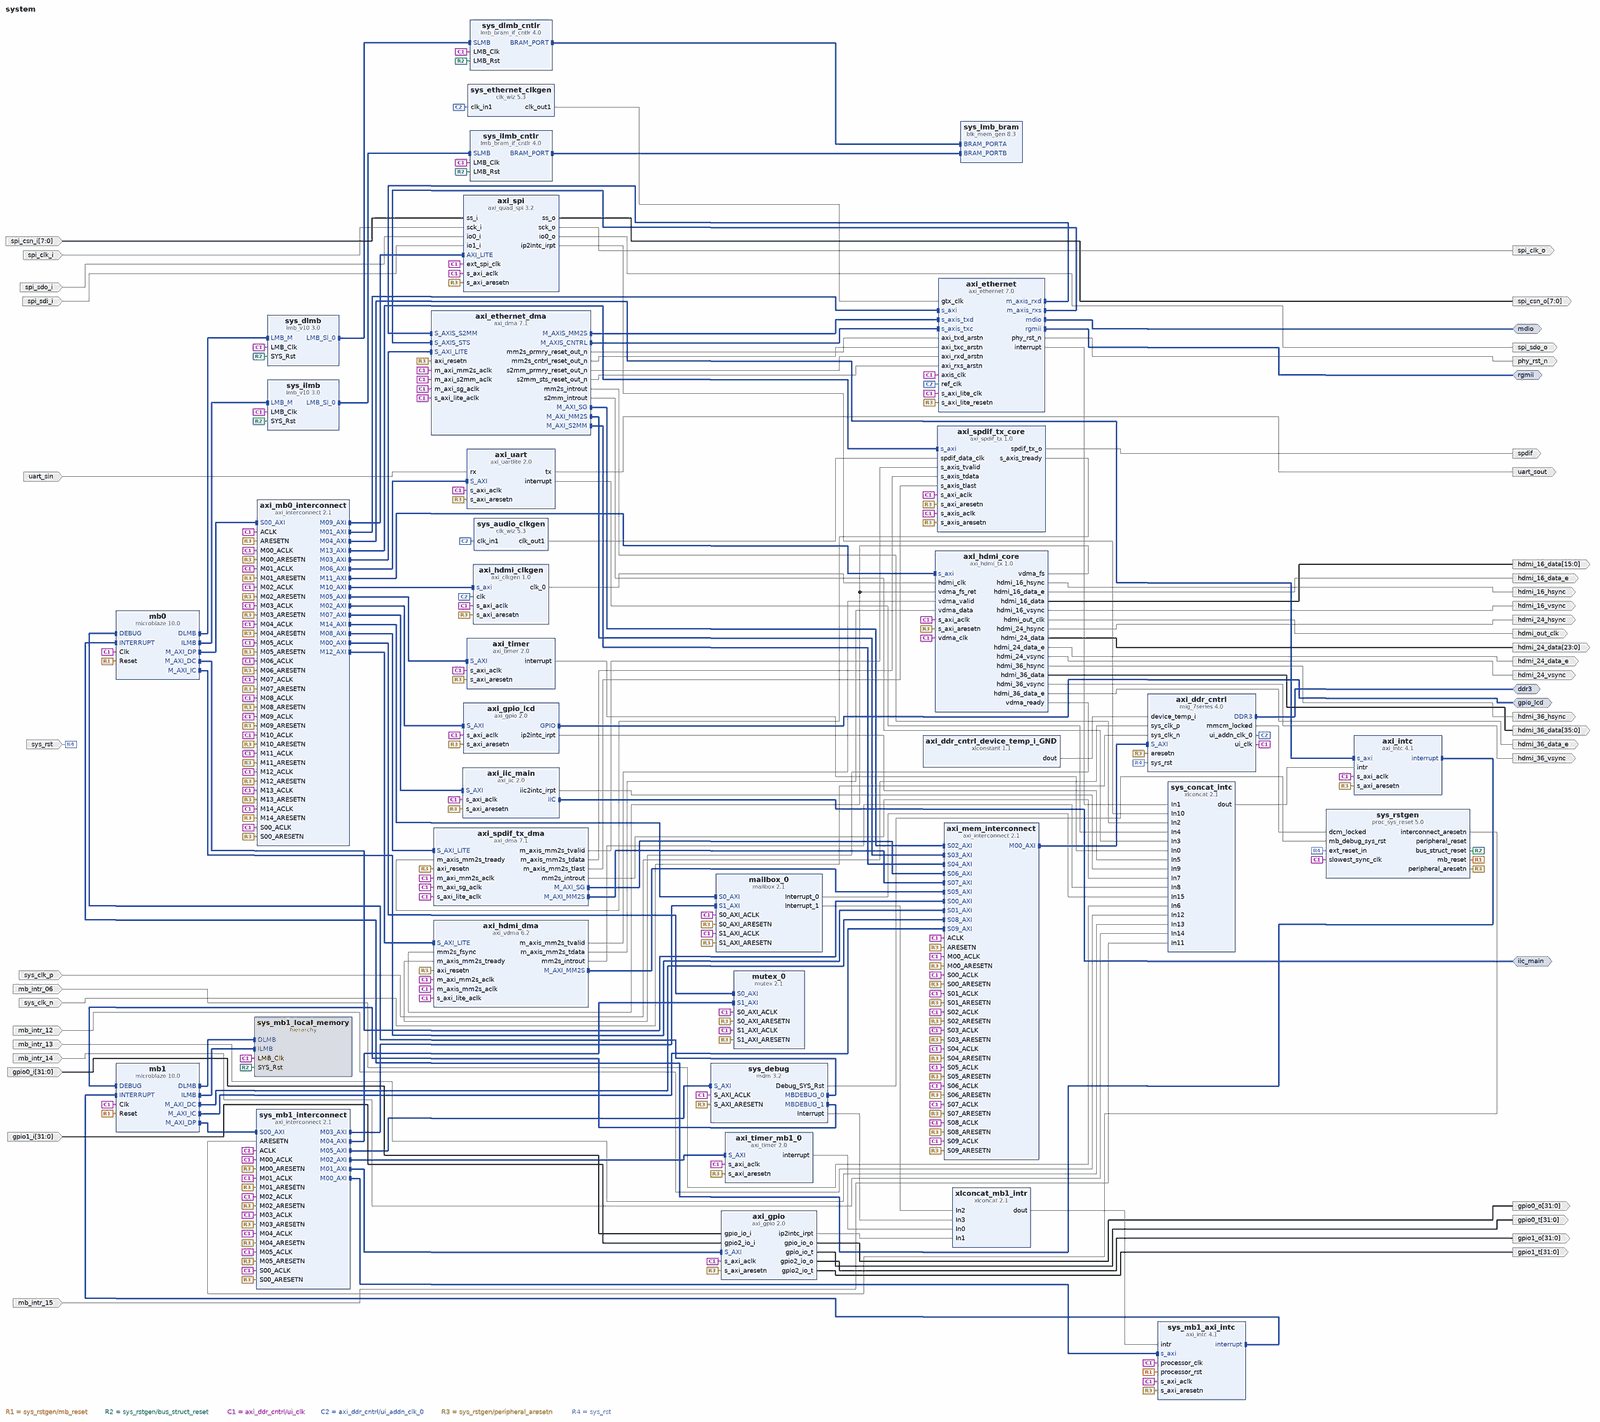
[diagram p0: block diagram of the top level, whole]
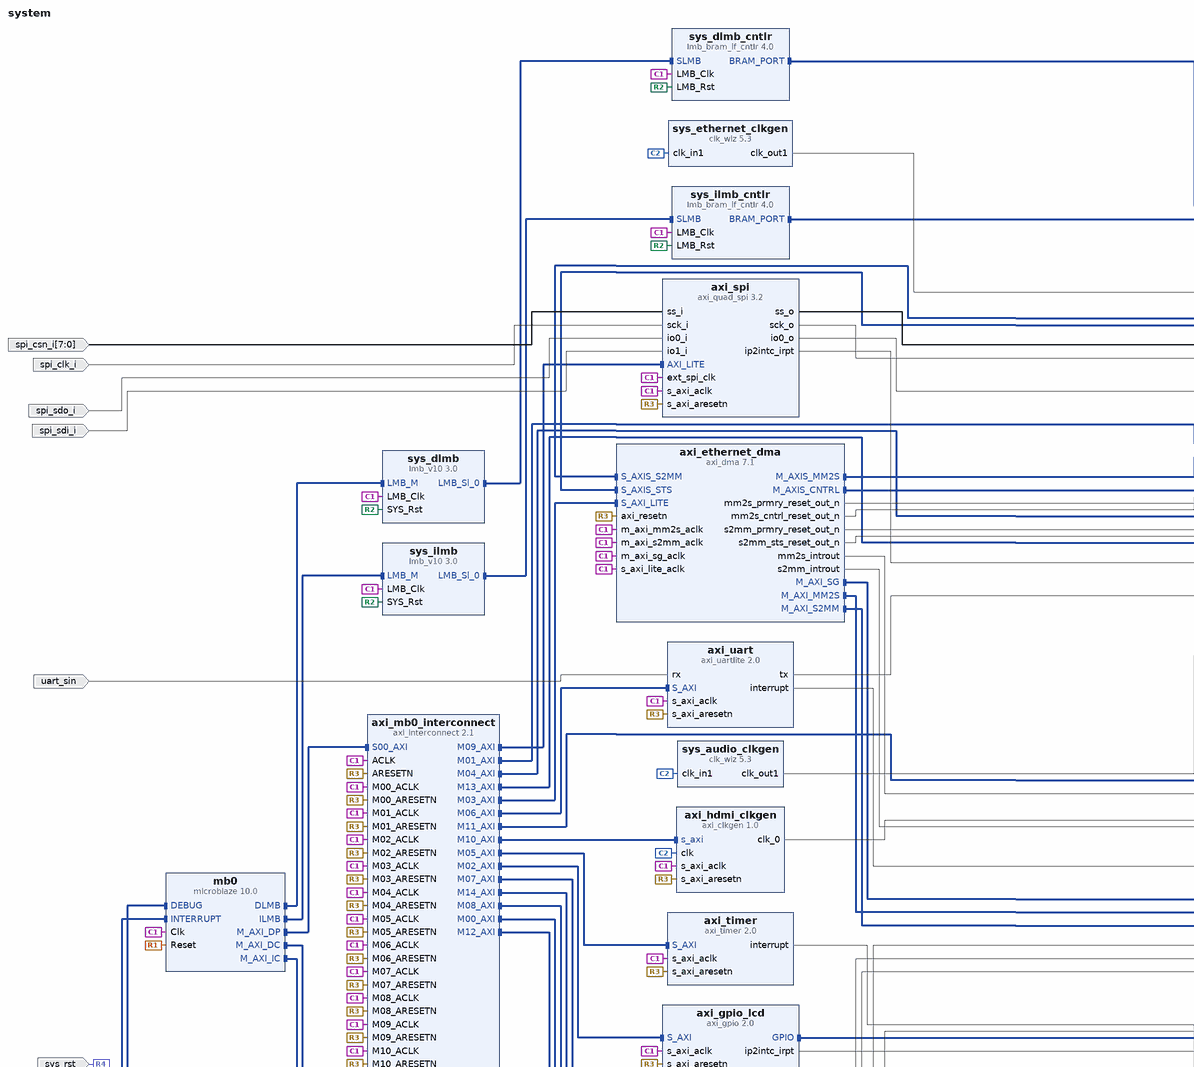
[diagram p1: block diagram of the top level, upper left part]
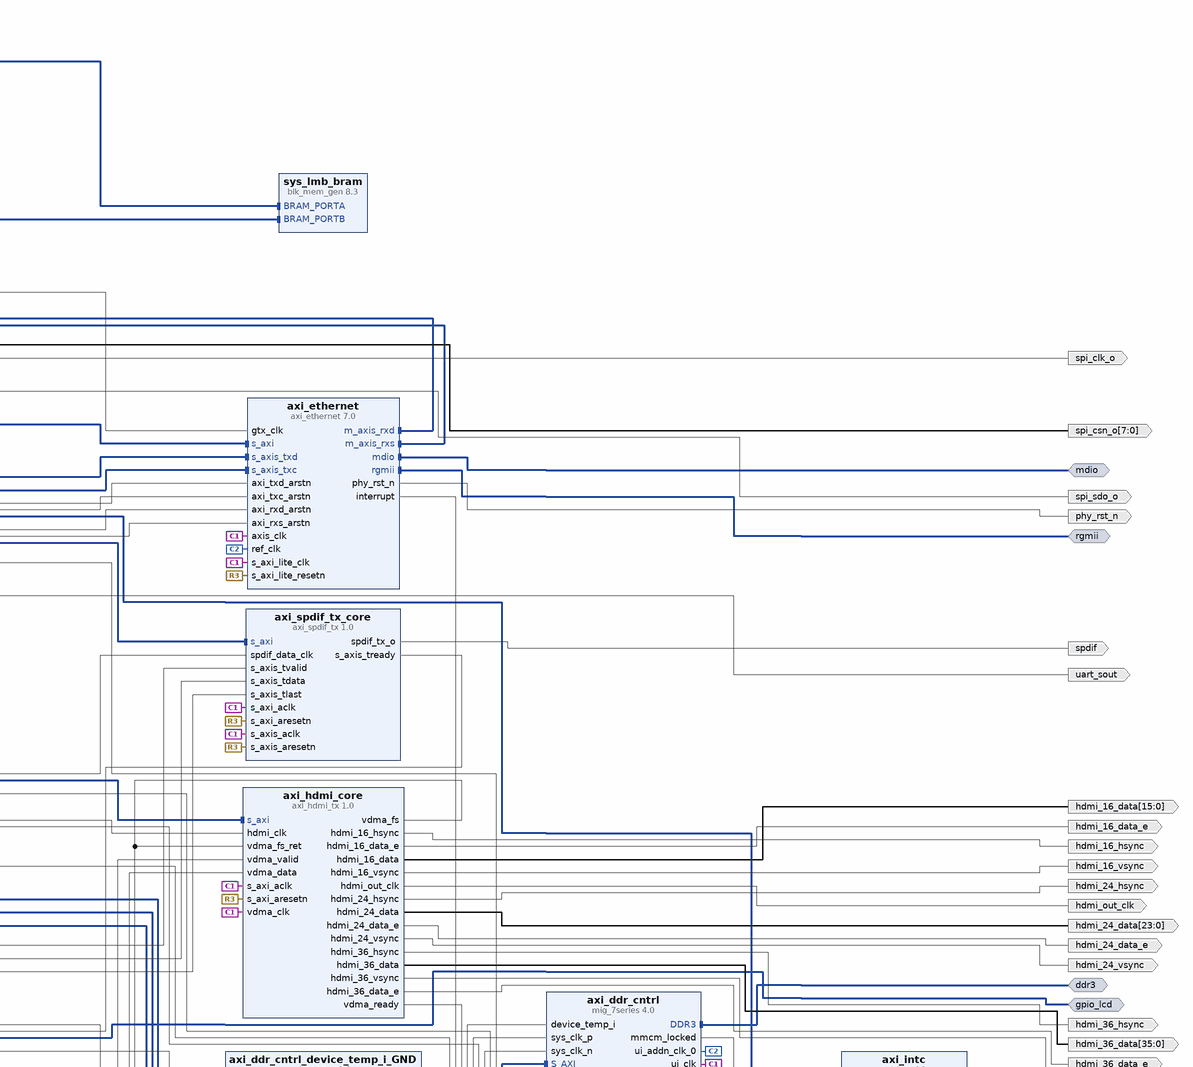
[diagram p2: block diagram of the top level, upper right part]
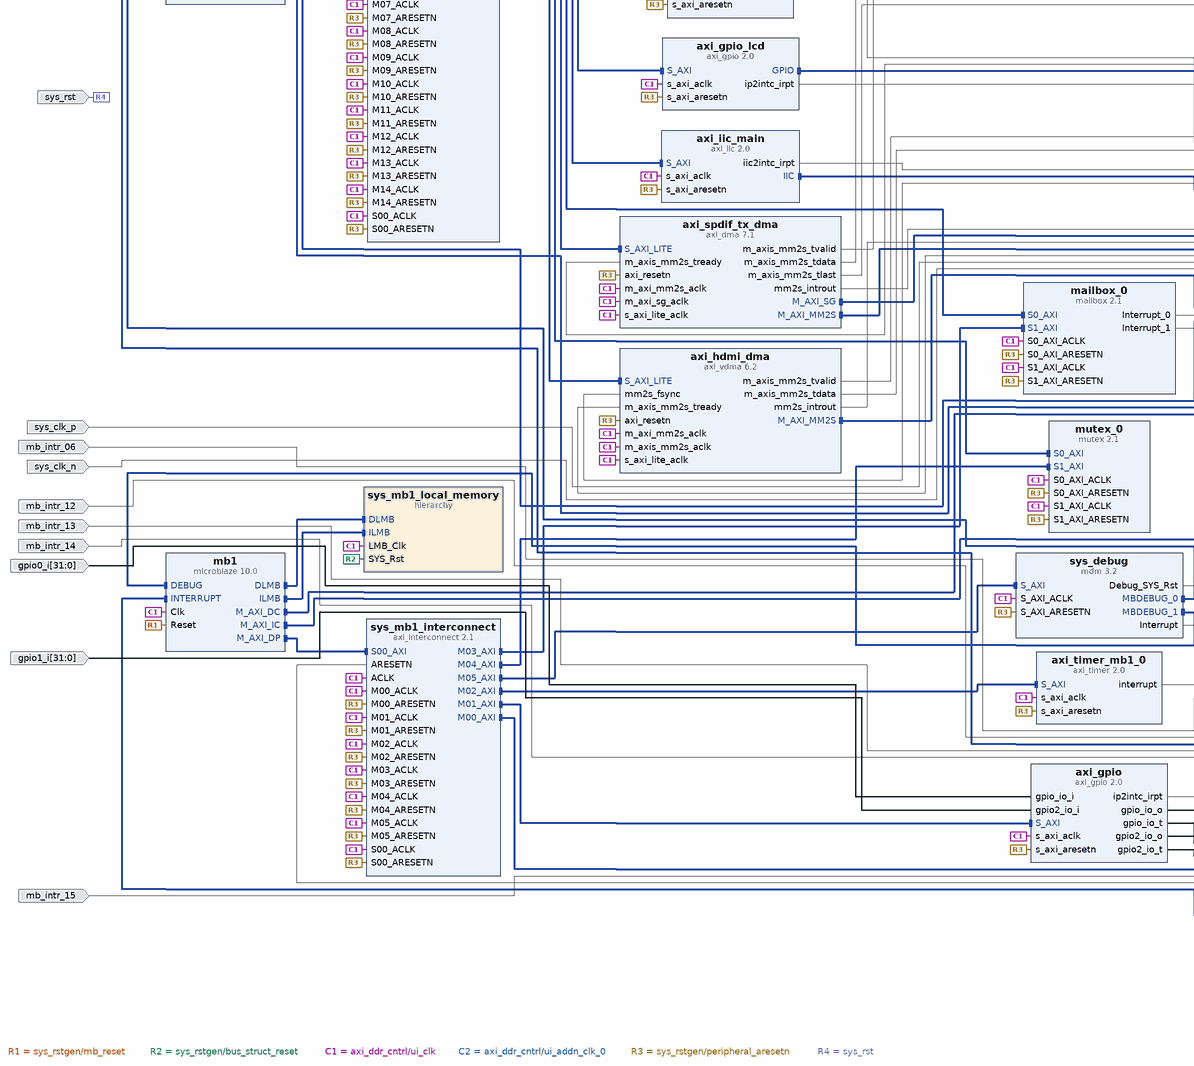
[diagram p3: block diagram of the top level, lower left part]
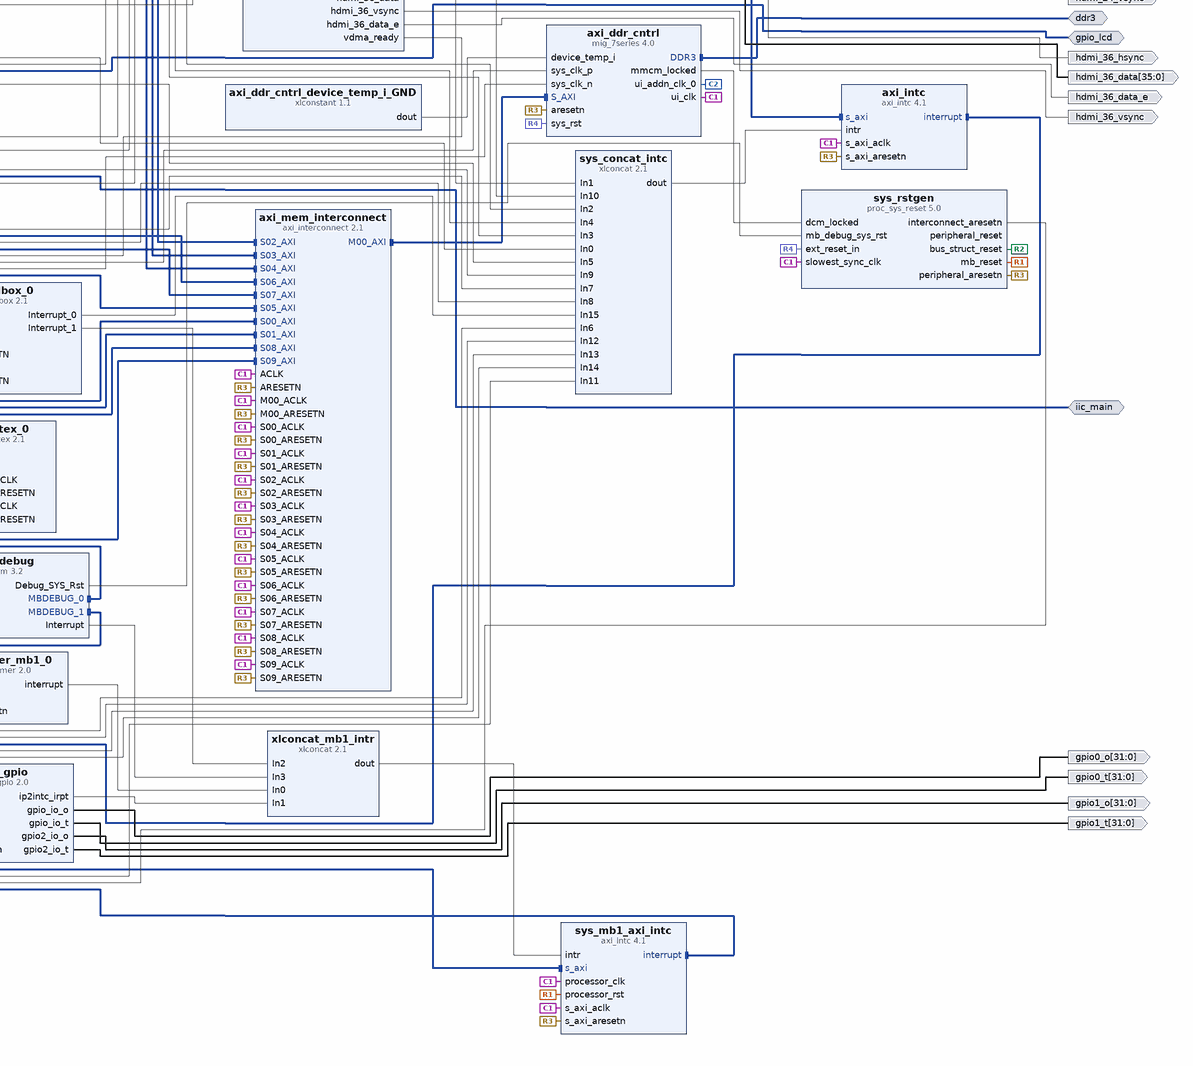
[diagram p4: block diagram of the top level, lower right part]
# Vivado block design system, xc7a200tfbg676-2, Vivado 2016.4
create_bd_design system

create_bd_intf_port -mode Master -vlnv xilinx.com:interface:ddrx_rtl:1.0 ddr3
create_bd_intf_port -mode Master -vlnv xilinx.com:interface:mdio_io:1.0 mdio
create_bd_intf_port -mode Master -vlnv xilinx.com:interface:rgmii_rtl:1.0 rgmii
create_bd_intf_port -mode Master -vlnv xilinx.com:interface:iic_rtl:1.0 iic_main
create_bd_intf_port -mode Master -vlnv xilinx.com:interface:gpio_rtl:1.0 gpio_lcd
create_bd_port -dir I -type intr mb_intr_06
create_bd_port -dir I -type intr mb_intr_12
create_bd_port -dir I -type intr mb_intr_13
create_bd_port -dir I -type intr mb_intr_14
create_bd_port -dir I -type rst sys_rst
set_property -dict {CONFIG.POLARITY ACTIVE_HIGH} [get_bd_ports sys_rst]
create_bd_port -dir I sys_clk_p
create_bd_port -dir I sys_clk_n
create_bd_port -dir I uart_sin
create_bd_port -dir O uart_sout
create_bd_port -dir I -from 7 -to 0 spi_csn_i
create_bd_port -dir O -from 7 -to 0 spi_csn_o
create_bd_port -dir I spi_clk_i
create_bd_port -dir O spi_clk_o
create_bd_port -dir I spi_sdo_i
create_bd_port -dir O spi_sdo_o
create_bd_port -dir I spi_sdi_i
create_bd_port -dir I -from 31 -to 0 gpio0_i
create_bd_port -dir O -from 31 -to 0 gpio0_o
create_bd_port -dir O -from 31 -to 0 gpio0_t
create_bd_port -dir I -from 31 -to 0 gpio1_i
create_bd_port -dir O -from 31 -to 0 gpio1_o
create_bd_port -dir O -from 31 -to 0 gpio1_t
create_bd_port -dir O -type rst phy_rst_n
create_bd_port -dir O hdmi_out_clk
create_bd_port -dir O hdmi_16_hsync
create_bd_port -dir O hdmi_16_vsync
create_bd_port -dir O hdmi_16_data_e
create_bd_port -dir O -from 15 -to 0 hdmi_16_data
create_bd_port -dir O hdmi_24_hsync
create_bd_port -dir O hdmi_24_vsync
create_bd_port -dir O hdmi_24_data_e
create_bd_port -dir O -from 23 -to 0 hdmi_24_data
create_bd_port -dir O hdmi_36_hsync
create_bd_port -dir O hdmi_36_vsync
create_bd_port -dir O hdmi_36_data_e
create_bd_port -dir O -from 35 -to 0 hdmi_36_data
create_bd_port -dir O spdif
create_bd_port -dir I -type intr mb_intr_15

create_bd_cell -type ip -vlnv xilinx.com:ip:microblaze:10.0 mb0
set_property -dict {CONFIG.G_TEMPLATE_LIST 4 CONFIG.C_CACHE_BYTE_SIZE 65536 CONFIG.C_DCACHE_BYTE_SIZE 65536} [get_bd_cells mb0]
create_bd_cell -type ip -vlnv xilinx.com:ip:lmb_v10:3.0 sys_dlmb
create_bd_cell -type ip -vlnv xilinx.com:ip:lmb_v10:3.0 sys_ilmb
create_bd_cell -type ip -vlnv xilinx.com:ip:lmb_bram_if_cntlr:4.0 sys_dlmb_cntlr
set_property -dict {CONFIG.C_ECC 0} [get_bd_cells sys_dlmb_cntlr]
create_bd_cell -type ip -vlnv xilinx.com:ip:lmb_bram_if_cntlr:4.0 sys_ilmb_cntlr
set_property -dict {CONFIG.C_ECC 0} [get_bd_cells sys_ilmb_cntlr]
create_bd_cell -type ip -vlnv xilinx.com:ip:blk_mem_gen:8.3 sys_lmb_bram
set_property -dict {CONFIG.Memory_Type True_Dual_Port_RAM CONFIG.use_bram_block BRAM_Controller} [get_bd_cells sys_lmb_bram]
create_bd_cell -type ip -vlnv xilinx.com:ip:mdm:3.2 sys_debug
set_property -dict [list \
  CONFIG.C_JTAG_CHAIN 2 \
  CONFIG.C_S_AXI_ADDR_WIDTH 5 \
  CONFIG.C_MB_DBG_PORTS 2 \
  CONFIG.C_USE_UART 1 \
  CONFIG.C_DBG_REG_ACCESS 1 \
  CONFIG.C_DBG_MEM_ACCESS 0 \
  CONFIG.C_USE_CROSS_TRIGGER 0 \
  CONFIG.C_TRACE_OUTPUT 0 \
] [get_bd_cells sys_debug]
create_bd_cell -type ip -vlnv xilinx.com:ip:proc_sys_reset:5.0 sys_rstgen
create_bd_cell -type ip -vlnv xilinx.com:ip:mig_7series:4.0 axi_ddr_cntrl
set_property -dict {CONFIG.XML_INPUT_FILE ac701_system_mig.prj} [get_bd_cells axi_ddr_cntrl]
create_bd_cell -type ip -vlnv xilinx.com:ip:clk_wiz:5.3 sys_ethernet_clkgen
set_property -dict {CONFIG.PRIM_IN_FREQ 200.000 CONFIG.CLKOUT1_REQUESTED_OUT_FREQ 125.000} [get_bd_cells sys_ethernet_clkgen]
create_bd_cell -type ip -vlnv xilinx.com:ip:axi_ethernet:7.0 axi_ethernet
set_property -dict {CONFIG.PHY_TYPE RGMII} [get_bd_cells axi_ethernet]
create_bd_cell -type ip -vlnv xilinx.com:ip:axi_dma:7.1 axi_ethernet_dma
set_property -dict [list \
  CONFIG.c_include_mm2s_dre 1 \
  CONFIG.c_sg_use_stsapp_length 1 \
  CONFIG.c_include_s2mm_dre 1 \
] [get_bd_cells axi_ethernet_dma]
create_bd_cell -type ip -vlnv xilinx.com:ip:axi_iic:2.0 axi_iic_main
create_bd_cell -type ip -vlnv xilinx.com:ip:axi_uartlite:2.0 axi_uart
set_property -dict {CONFIG.C_BAUDRATE 115200} [get_bd_cells axi_uart]
create_bd_cell -type ip -vlnv xilinx.com:ip:axi_timer:2.0 axi_timer
create_bd_cell -type ip -vlnv xilinx.com:ip:axi_gpio:2.0 axi_gpio_lcd
set_property -dict {CONFIG.C_GPIO_WIDTH 7 CONFIG.C_INTERRUPT_PRESENT 1} [get_bd_cells axi_gpio_lcd]
create_bd_cell -type ip -vlnv xilinx.com:ip:axi_quad_spi:3.2 axi_spi
set_property -dict {CONFIG.C_USE_STARTUP 0 CONFIG.C_NUM_SS_BITS 8 CONFIG.C_SCK_RATIO 8} [get_bd_cells axi_spi]
create_bd_cell -type ip -vlnv xilinx.com:ip:axi_gpio:2.0 axi_gpio
set_property -dict [list \
  CONFIG.C_GPIO_WIDTH 32 \
  CONFIG.C_GPIO2_WIDTH 32 \
  CONFIG.C_IS_DUAL 1 \
  CONFIG.C_INTERRUPT_PRESENT 1 \
] [get_bd_cells axi_gpio]
create_bd_cell -type ip -vlnv xilinx.com:ip:axi_intc:4.1 axi_intc
set_property -dict {CONFIG.C_HAS_FAST 0} [get_bd_cells axi_intc]
create_bd_cell -type ip -vlnv xilinx.com:ip:xlconcat:2.1 sys_concat_intc
set_property -dict {CONFIG.NUM_PORTS 16} [get_bd_cells sys_concat_intc]
create_bd_cell -type ip -vlnv xilinx.com:ip:xlconstant:1.1 axi_ddr_cntrl_device_temp_i_GND
set_property -dict {CONFIG.CONST_WIDTH 12 CONFIG.CONST_VAL 0} [get_bd_cells axi_ddr_cntrl_device_temp_i_GND]
create_bd_cell -type ip -vlnv xilinx.com:ip:axi_interconnect:2.1 axi_mb0_interconnect
set_property -dict {CONFIG.NUM_MI 15} [get_bd_cells axi_mb0_interconnect]
create_bd_cell -type ip -vlnv xilinx.com:ip:axi_interconnect:2.1 axi_mem_interconnect
set_property -dict {CONFIG.NUM_SI 10 CONFIG.NUM_MI 1 CONFIG.STRATEGY 2} [get_bd_cells axi_mem_interconnect]
create_bd_cell -type ip -vlnv analog.com:user:axi_clkgen:1.0 axi_hdmi_clkgen
create_bd_cell -type ip -vlnv analog.com:user:axi_hdmi_tx:1.0 axi_hdmi_core
create_bd_cell -type ip -vlnv xilinx.com:ip:axi_vdma:6.2 axi_hdmi_dma
set_property -dict [list \
  CONFIG.c_m_axi_mm2s_data_width 512 \
  CONFIG.c_m_axis_mm2s_tdata_width 64 \
  CONFIG.c_use_mm2s_fsync 1 \
  CONFIG.c_include_s2mm 0 \
] [get_bd_cells axi_hdmi_dma]
create_bd_cell -type ip -vlnv xilinx.com:ip:clk_wiz:5.3 sys_audio_clkgen
set_property -dict [list \
  CONFIG.USE_PHASE_ALIGNMENT false \
  CONFIG.CLKOUT1_REQUESTED_OUT_FREQ 12.288 \
  CONFIG.PRIM_SOURCE No_buffer \
  CONFIG.USE_LOCKED false \
  CONFIG.USE_RESET false \
] [get_bd_cells sys_audio_clkgen]
create_bd_cell -type ip -vlnv analog.com:user:axi_spdif_tx:1.0 axi_spdif_tx_core
set_property -dict {CONFIG.S_AXI_ADDRESS_WIDTH 16 CONFIG.DMA_TYPE 0} [get_bd_cells axi_spdif_tx_core]
create_bd_cell -type ip -vlnv xilinx.com:ip:axi_dma:7.1 axi_spdif_tx_dma
set_property -dict {CONFIG.c_sg_include_stscntrl_strm 0 CONFIG.c_include_s2mm 0} [get_bd_cells axi_spdif_tx_dma]
create_bd_cell -type ip -vlnv xilinx.com:ip:microblaze:10.0 mb1
set_property -dict [list \
  CONFIG.C_D_AXI 1 \
  CONFIG.C_D_LMB 1 \
  CONFIG.C_I_LMB 1 \
  CONFIG.G_TEMPLATE_LIST 4 \
  CONFIG.C_DEBUG_ENABLED 2 \
  CONFIG.C_FSL_LINKS 0 \
  CONFIG.C_USE_ICACHE 1 \
  CONFIG.C_CACHE_BYTE_SIZE 8192 \
  CONFIG.C_USE_DCACHE 1 \
  CONFIG.C_DCACHE_BYTE_SIZE 8192 \
] [get_bd_cells mb1]
create_bd_cell -type hier sys_mb1_local_memory
create_bd_cell -type ip -vlnv xilinx.com:ip:axi_interconnect:2.1 sys_mb1_interconnect
set_property -dict {CONFIG.NUM_MI 6} [get_bd_cells sys_mb1_interconnect]
create_bd_cell -type ip -vlnv xilinx.com:ip:axi_intc:4.1 sys_mb1_axi_intc
set_property -dict {CONFIG.C_HAS_FAST 1} [get_bd_cells sys_mb1_axi_intc]
create_bd_cell -type ip -vlnv xilinx.com:ip:axi_timer:2.0 axi_timer_mb1_0
create_bd_cell -type ip -vlnv xilinx.com:ip:mailbox:2.1 mailbox_0
set_property -dict {CONFIG.C_ASYNC_CLKS 0 CONFIG.C_IMPL_STYLE 0 CONFIG.C_MAILBOX_DEPTH 16} [get_bd_cells mailbox_0]
create_bd_cell -type ip -vlnv xilinx.com:ip:xlconcat:2.1 xlconcat_mb1_intr
set_property -dict {CONFIG.NUM_PORTS 4} [get_bd_cells xlconcat_mb1_intr]
create_bd_cell -type ip -vlnv xilinx.com:ip:mutex:2.1 mutex_0

# ---- hierarchy /sys_mb1_local_memory ----
current_bd_instance /sys_mb1_local_memory
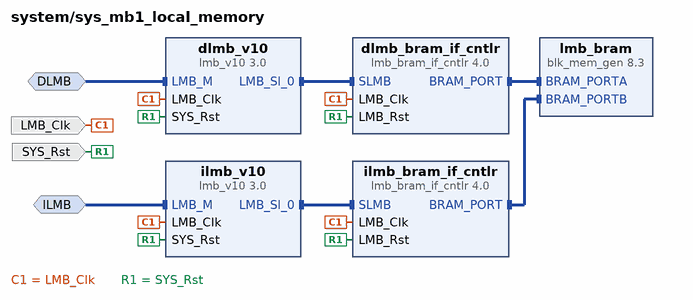
[diagram p5: block diagram inside /sys_mb1_local_memory]
create_bd_intf_pin -mode MirroredMaster -vlnv xilinx.com:interface:lmb_rtl:1.0 DLMB
create_bd_intf_pin -mode MirroredMaster -vlnv xilinx.com:interface:lmb_rtl:1.0 ILMB
create_bd_pin -dir I -type clk LMB_Clk
create_bd_pin -dir I -type rst SYS_Rst

create_bd_cell -type ip -vlnv xilinx.com:ip:lmb_v10:3.0 dlmb_v10
create_bd_cell -type ip -vlnv xilinx.com:ip:lmb_v10:3.0 ilmb_v10
create_bd_cell -type ip -vlnv xilinx.com:ip:lmb_bram_if_cntlr:4.0 dlmb_bram_if_cntlr
set_property -dict {CONFIG.C_ECC 0} [get_bd_cells dlmb_bram_if_cntlr]
create_bd_cell -type ip -vlnv xilinx.com:ip:lmb_bram_if_cntlr:4.0 ilmb_bram_if_cntlr
set_property -dict {CONFIG.C_ECC 0} [get_bd_cells ilmb_bram_if_cntlr]
create_bd_cell -type ip -vlnv xilinx.com:ip:blk_mem_gen:8.3 lmb_bram
set_property -dict {CONFIG.Memory_Type True_Dual_Port_RAM CONFIG.use_bram_block BRAM_Controller} [get_bd_cells lmb_bram]

# ---- connections ----

current_bd_instance /sys_mb1_local_memory
connect_bd_intf_net -intf_net sys_mb1_dlmb_bus [get_bd_intf_pins dlmb_v10/LMB_Sl_0] [get_bd_intf_pins dlmb_bram_if_cntlr/SLMB]
connect_bd_intf_net -intf_net sys_mb1_ilmb_bus [get_bd_intf_pins ilmb_v10/LMB_Sl_0] [get_bd_intf_pins ilmb_bram_if_cntlr/SLMB]
connect_bd_intf_net -intf_net sys_mb1_dlmb_cntlr [get_bd_intf_pins dlmb_bram_if_cntlr/BRAM_PORT] [get_bd_intf_pins lmb_bram/BRAM_PORTA]
connect_bd_intf_net -intf_net sys_mb1_ilmb_cntlr [get_bd_intf_pins ilmb_bram_if_cntlr/BRAM_PORT] [get_bd_intf_pins lmb_bram/BRAM_PORTB]
connect_bd_intf_net -intf_net sys_mb1_dlmb [get_bd_intf_pins DLMB] [get_bd_intf_pins dlmb_v10/LMB_M]
connect_bd_intf_net -intf_net sys_mb1_ilmb [get_bd_intf_pins ILMB] [get_bd_intf_pins ilmb_v10/LMB_M]
connect_bd_net -net sys_mb1_Clk [get_bd_pins LMB_Clk] \
  [get_bd_pins dlmb_v10/LMB_Clk] [get_bd_pins dlmb_bram_if_cntlr/LMB_Clk] [get_bd_pins ilmb_v10/LMB_Clk] \
  [get_bd_pins ilmb_bram_if_cntlr/LMB_Clk]
connect_bd_net [get_bd_pins SYS_Rst] \
  [get_bd_pins dlmb_v10/SYS_Rst] [get_bd_pins dlmb_bram_if_cntlr/LMB_Rst] [get_bd_pins ilmb_v10/SYS_Rst] \
  [get_bd_pins ilmb_bram_if_cntlr/LMB_Rst]

current_bd_instance /
connect_bd_intf_net [get_bd_intf_pins sys_dlmb/LMB_Sl_0] [get_bd_intf_pins sys_dlmb_cntlr/SLMB]
connect_bd_intf_net [get_bd_intf_pins sys_ilmb/LMB_Sl_0] [get_bd_intf_pins sys_ilmb_cntlr/SLMB]
connect_bd_intf_net [get_bd_intf_pins sys_dlmb_cntlr/BRAM_PORT] [get_bd_intf_pins sys_lmb_bram/BRAM_PORTA]
connect_bd_intf_net [get_bd_intf_pins sys_ilmb_cntlr/BRAM_PORT] [get_bd_intf_pins sys_lmb_bram/BRAM_PORTB]
connect_bd_intf_net -intf_net sys_mb_DLMB [get_bd_intf_pins mb0/DLMB] [get_bd_intf_pins sys_dlmb/LMB_M]
connect_bd_intf_net -intf_net sys_mb_ILMB [get_bd_intf_pins mb0/ILMB] [get_bd_intf_pins sys_ilmb/LMB_M]
connect_bd_intf_net [get_bd_intf_pins axi_intc/interrupt] [get_bd_intf_pins mb0/INTERRUPT]
connect_bd_intf_net [get_bd_intf_pins axi_ethernet/s_axis_txd] [get_bd_intf_pins axi_ethernet_dma/M_AXIS_MM2S]
connect_bd_intf_net [get_bd_intf_pins axi_ethernet/s_axis_txc] [get_bd_intf_pins axi_ethernet_dma/M_AXIS_CNTRL]
connect_bd_intf_net [get_bd_intf_pins axi_ethernet/m_axis_rxd] [get_bd_intf_pins axi_ethernet_dma/S_AXIS_S2MM]
connect_bd_intf_net [get_bd_intf_pins axi_ethernet/m_axis_rxs] [get_bd_intf_pins axi_ethernet_dma/S_AXIS_STS]
connect_bd_intf_net [get_bd_intf_pins axi_mb0_interconnect/S00_AXI] [get_bd_intf_pins mb0/M_AXI_DP]
connect_bd_intf_net -intf_net axi_cpu_interconnect_M01_AXI [get_bd_intf_pins axi_mb0_interconnect/M01_AXI] [get_bd_intf_pins axi_ethernet/s_axi]
connect_bd_intf_net -intf_net axi_cpu_interconnect_M02_AXI [get_bd_intf_pins axi_mb0_interconnect/M02_AXI] [get_bd_intf_pins axi_gpio_lcd/S_AXI]
connect_bd_intf_net -intf_net axi_cpu_interconnect_M03_AXI [get_bd_intf_pins axi_mb0_interconnect/M03_AXI] [get_bd_intf_pins axi_ethernet_dma/S_AXI_LITE]
connect_bd_intf_net -intf_net axi_cpu_interconnect_M04_AXI [get_bd_intf_pins axi_mb0_interconnect/M04_AXI] [get_bd_intf_pins axi_intc/s_axi]
connect_bd_intf_net -intf_net axi_cpu_interconnect_M05_AXI [get_bd_intf_pins axi_mb0_interconnect/M05_AXI] [get_bd_intf_pins axi_timer/S_AXI]
connect_bd_intf_net -intf_net axi_cpu_interconnect_M07_AXI [get_bd_intf_pins axi_mb0_interconnect/M07_AXI] [get_bd_intf_pins axi_iic_main/S_AXI]
connect_bd_intf_net -intf_net axi_cpu_interconnect_M09_AXI [get_bd_intf_pins axi_mb0_interconnect/M09_AXI] [get_bd_intf_pins axi_spi/AXI_LITE]
connect_bd_intf_net [get_bd_intf_pins axi_mem_interconnect/M00_AXI] [get_bd_intf_pins axi_ddr_cntrl/S_AXI]
connect_bd_intf_net [get_bd_intf_pins axi_mem_interconnect/S00_AXI] [get_bd_intf_pins mb0/M_AXI_DC]
connect_bd_intf_net [get_bd_intf_pins axi_mem_interconnect/S01_AXI] [get_bd_intf_pins mb0/M_AXI_IC]
connect_bd_intf_net [get_bd_intf_pins axi_mem_interconnect/S02_AXI] [get_bd_intf_pins axi_ethernet_dma/M_AXI_SG]
connect_bd_intf_net [get_bd_intf_pins axi_mem_interconnect/S03_AXI] [get_bd_intf_pins axi_ethernet_dma/M_AXI_MM2S]
connect_bd_intf_net [get_bd_intf_pins axi_mem_interconnect/S04_AXI] [get_bd_intf_pins axi_ethernet_dma/M_AXI_S2MM]
connect_bd_intf_net -intf_net axi_cpu_interconnect_M10_AXI [get_bd_intf_pins axi_mb0_interconnect/M10_AXI] [get_bd_intf_pins axi_hdmi_clkgen/s_axi]
connect_bd_intf_net -intf_net axi_cpu_interconnect_M11_AXI [get_bd_intf_pins axi_mb0_interconnect/M11_AXI] [get_bd_intf_pins axi_hdmi_core/s_axi]
connect_bd_intf_net -intf_net axi_cpu_interconnect_M12_AXI [get_bd_intf_pins axi_mb0_interconnect/M12_AXI] [get_bd_intf_pins axi_hdmi_dma/S_AXI_LITE]
connect_bd_intf_net -intf_net axi_cpu_interconnect_M13_AXI [get_bd_intf_pins axi_mb0_interconnect/M13_AXI] [get_bd_intf_pins axi_spdif_tx_core/s_axi]
connect_bd_intf_net [get_bd_intf_pins axi_mem_interconnect/S05_AXI] [get_bd_intf_pins axi_hdmi_dma/M_AXI_MM2S]
connect_bd_intf_net [get_bd_intf_pins axi_mem_interconnect/S06_AXI] [get_bd_intf_pins axi_spdif_tx_dma/M_AXI_SG]
connect_bd_intf_net [get_bd_intf_pins axi_mem_interconnect/S07_AXI] [get_bd_intf_pins axi_spdif_tx_dma/M_AXI_MM2S]
connect_bd_intf_net -intf_net sys_mb1_dlmb_1 [get_bd_intf_pins mb1/DLMB] [get_bd_intf_pins sys_mb1_local_memory/DLMB]
connect_bd_intf_net -intf_net sys_mb1_ilmb_1 [get_bd_intf_pins mb1/ILMB] [get_bd_intf_pins sys_mb1_local_memory/ILMB]
connect_bd_intf_net -intf_net sys_mb1_axi_dp [get_bd_intf_pins sys_mb1_interconnect/S00_AXI] [get_bd_intf_pins mb1/M_AXI_DP]
connect_bd_intf_net -intf_net sys_mb1_interrupt [get_bd_intf_pins sys_mb1_axi_intc/interrupt] [get_bd_intf_pins mb1/INTERRUPT]
connect_bd_intf_net -intf_net sys_mb1_intc_axi [get_bd_intf_pins sys_mb1_interconnect/M00_AXI] [get_bd_intf_pins sys_mb1_axi_intc/s_axi]
connect_bd_intf_net -intf_net sys_mb1_M_AXI_DC [get_bd_intf_pins mb1/M_AXI_DC] [get_bd_intf_pins axi_mem_interconnect/S08_AXI]
connect_bd_intf_net -intf_net sys_mb1_M_AXI_IC [get_bd_intf_pins mb1/M_AXI_IC] [get_bd_intf_pins axi_mem_interconnect/S09_AXI]
connect_bd_intf_net [get_bd_intf_pins axi_gpio/S_AXI] [get_bd_intf_pins sys_mb1_interconnect/M01_AXI]
connect_bd_intf_net -intf_net axi_cpu_interconnect_M08_AXI [get_bd_intf_pins axi_spdif_tx_dma/S_AXI_LITE] [get_bd_intf_pins axi_mb0_interconnect/M08_AXI]
connect_bd_intf_net [get_bd_intf_pins axi_timer_mb1_0/S_AXI] [get_bd_intf_pins sys_mb1_interconnect/M02_AXI]
connect_bd_intf_net [get_bd_intf_pins mailbox_0/S1_AXI] [get_bd_intf_pins sys_mb1_interconnect/M03_AXI]
connect_bd_intf_net -intf_net axi_cpu_interconnect_M14_AXI [get_bd_intf_pins axi_mb0_interconnect/M14_AXI] [get_bd_intf_pins mailbox_0/S0_AXI]
connect_bd_intf_net -intf_net axi_cpu_interconnect_M06_AXI [get_bd_intf_pins axi_uart/S_AXI] [get_bd_intf_pins axi_mb0_interconnect/M06_AXI]
connect_bd_intf_net [get_bd_intf_pins mutex_0/S1_AXI] [get_bd_intf_pins sys_mb1_interconnect/M04_AXI]
connect_bd_intf_net [get_bd_intf_pins sys_debug/S_AXI] [get_bd_intf_pins sys_mb1_interconnect/M05_AXI]
connect_bd_intf_net [get_bd_intf_pins mutex_0/S0_AXI] [get_bd_intf_pins axi_mb0_interconnect/M00_AXI]
connect_bd_intf_net [get_bd_intf_pins sys_debug/MBDEBUG_1] [get_bd_intf_pins mb1/DEBUG]
connect_bd_intf_net [get_bd_intf_pins mb0/DEBUG] [get_bd_intf_pins sys_debug/MBDEBUG_0]
connect_bd_intf_net [get_bd_intf_ports ddr3] [get_bd_intf_pins axi_ddr_cntrl/DDR3]
connect_bd_intf_net [get_bd_intf_ports mdio] [get_bd_intf_pins axi_ethernet/mdio]
connect_bd_intf_net [get_bd_intf_ports rgmii] [get_bd_intf_pins axi_ethernet/rgmii]
connect_bd_intf_net [get_bd_intf_ports iic_main] [get_bd_intf_pins axi_iic_main/IIC]
connect_bd_intf_net [get_bd_intf_ports gpio_lcd] [get_bd_intf_pins axi_gpio_lcd/GPIO]
connect_bd_net -net mdm_1_debug_sys_rst [get_bd_pins sys_debug/Debug_SYS_Rst] [get_bd_pins sys_rstgen/mb_debug_sys_rst]
connect_bd_net [get_bd_pins sys_rstgen/mb_reset] [get_bd_pins mb0/Reset] [get_bd_pins mb1/Reset] [get_bd_pins sys_mb1_axi_intc/processor_rst]
connect_bd_net [get_bd_pins sys_rstgen/bus_struct_reset] \
  [get_bd_pins sys_dlmb/SYS_Rst] [get_bd_pins sys_ilmb/SYS_Rst] [get_bd_pins sys_dlmb_cntlr/LMB_Rst] \
  [get_bd_pins sys_ilmb_cntlr/LMB_Rst] [get_bd_pins sys_mb1_local_memory/SYS_Rst]
connect_bd_net [get_bd_pins sys_concat_intc/dout] [get_bd_pins axi_intc/intr]
connect_bd_net [get_bd_pins axi_ddr_cntrl/mmcm_locked] [get_bd_pins sys_rstgen/dcm_locked]
connect_bd_net [get_bd_pins axi_ddr_cntrl_device_temp_i_GND/dout] [get_bd_pins axi_ddr_cntrl/device_temp_i]
connect_bd_net -net sys_mb1_Clk [get_bd_pins axi_ddr_cntrl/ui_clk] \
  [get_bd_pins sys_rstgen/slowest_sync_clk] [get_bd_pins mb0/Clk] [get_bd_pins sys_dlmb/LMB_Clk] \
  [get_bd_pins sys_ilmb/LMB_Clk] [get_bd_pins sys_dlmb_cntlr/LMB_Clk] [get_bd_pins sys_ilmb_cntlr/LMB_Clk] \
  [get_bd_pins axi_spi/ext_spi_clk] [get_bd_pins axi_ethernet/axis_clk] [get_bd_pins sys_debug/S_AXI_ACLK] \
  [get_bd_pins axi_ethernet/s_axi_lite_clk] [get_bd_pins axi_gpio_lcd/s_axi_aclk] \
  [get_bd_pins axi_ethernet_dma/s_axi_lite_aclk] [get_bd_pins axi_intc/s_axi_aclk] [get_bd_pins axi_timer/s_axi_aclk] \
  [get_bd_pins axi_uart/s_axi_aclk] [get_bd_pins axi_iic_main/s_axi_aclk] [get_bd_pins axi_gpio/s_axi_aclk] \
  [get_bd_pins axi_spi/s_axi_aclk] [get_bd_pins axi_ethernet_dma/m_axi_sg_aclk] \
  [get_bd_pins axi_ethernet_dma/m_axi_mm2s_aclk] [get_bd_pins axi_ethernet_dma/m_axi_s2mm_aclk] \
  [get_bd_pins axi_hdmi_core/vdma_clk] [get_bd_pins axi_hdmi_dma/m_axis_mm2s_aclk] \
  [get_bd_pins axi_spdif_tx_core/s_axis_aclk] [get_bd_pins axi_hdmi_clkgen/s_axi_aclk] [get_bd_pins axi_hdmi_core/s_axi_aclk] \
  [get_bd_pins axi_hdmi_dma/s_axi_lite_aclk] [get_bd_pins axi_spdif_tx_core/s_axi_aclk] \
  [get_bd_pins axi_spdif_tx_dma/s_axi_lite_aclk] [get_bd_pins axi_hdmi_dma/m_axi_mm2s_aclk] \
  [get_bd_pins axi_spdif_tx_dma/m_axi_sg_aclk] [get_bd_pins axi_spdif_tx_dma/m_axi_mm2s_aclk] [get_bd_pins mb1/Clk] \
  [get_bd_pins sys_mb1_axi_intc/s_axi_aclk] [get_bd_pins sys_mb1_axi_intc/processor_clk] [get_bd_pins mailbox_0/S1_AXI_ACLK] \
  [get_bd_pins mailbox_0/S0_AXI_ACLK] [get_bd_pins axi_timer_mb1_0/s_axi_aclk] [get_bd_pins mutex_0/S0_AXI_ACLK] \
  [get_bd_pins mutex_0/S1_AXI_ACLK] [get_bd_pins axi_mb0_interconnect/ACLK] [get_bd_pins axi_mb0_interconnect/S00_ACLK] \
  [get_bd_pins axi_mb0_interconnect/M00_ACLK] [get_bd_pins axi_mb0_interconnect/M01_ACLK] \
  [get_bd_pins axi_mb0_interconnect/M02_ACLK] [get_bd_pins axi_mb0_interconnect/M03_ACLK] \
  [get_bd_pins axi_mb0_interconnect/M04_ACLK] [get_bd_pins axi_mb0_interconnect/M05_ACLK] \
  [get_bd_pins axi_mb0_interconnect/M06_ACLK] [get_bd_pins axi_mb0_interconnect/M07_ACLK] \
  [get_bd_pins axi_mb0_interconnect/M08_ACLK] [get_bd_pins axi_mb0_interconnect/M09_ACLK] \
  [get_bd_pins axi_mem_interconnect/ACLK] [get_bd_pins axi_mem_interconnect/M00_ACLK] \
  [get_bd_pins axi_mem_interconnect/S00_ACLK] [get_bd_pins axi_mem_interconnect/S01_ACLK] \
  [get_bd_pins axi_mem_interconnect/S02_ACLK] [get_bd_pins axi_mem_interconnect/S03_ACLK] \
  [get_bd_pins axi_mem_interconnect/S04_ACLK] [get_bd_pins axi_mb0_interconnect/M10_ACLK] \
  [get_bd_pins axi_mb0_interconnect/M11_ACLK] [get_bd_pins axi_mb0_interconnect/M12_ACLK] \
  [get_bd_pins axi_mb0_interconnect/M13_ACLK] [get_bd_pins axi_mem_interconnect/S05_ACLK] \
  [get_bd_pins axi_mem_interconnect/S06_ACLK] [get_bd_pins axi_mem_interconnect/S07_ACLK] \
  [get_bd_pins sys_mb1_interconnect/ACLK] [get_bd_pins sys_mb1_interconnect/S00_ACLK] \
  [get_bd_pins sys_mb1_interconnect/M00_ACLK] [get_bd_pins sys_mb1_local_memory/LMB_Clk] \
  [get_bd_pins axi_mem_interconnect/S08_ACLK] [get_bd_pins axi_mem_interconnect/S09_ACLK] \
  [get_bd_pins sys_mb1_interconnect/M01_ACLK] [get_bd_pins sys_mb1_interconnect/M02_ACLK] \
  [get_bd_pins sys_mb1_interconnect/M03_ACLK] [get_bd_pins axi_mb0_interconnect/M14_ACLK] \
  [get_bd_pins sys_mb1_interconnect/M04_ACLK] [get_bd_pins sys_mb1_interconnect/M05_ACLK]
connect_bd_net -net sys_200m_clk [get_bd_pins axi_ddr_cntrl/ui_addn_clk_0] \
  [get_bd_pins axi_ethernet/ref_clk] [get_bd_pins sys_ethernet_clkgen/clk_in1] [get_bd_pins axi_hdmi_clkgen/clk] \
  [get_bd_pins sys_audio_clkgen/clk_in1]
connect_bd_net -net sys_cpu_resetn [get_bd_pins sys_rstgen/peripheral_aresetn] \
  [get_bd_pins axi_ddr_cntrl/aresetn] [get_bd_pins sys_debug/S_AXI_ARESETN] [get_bd_pins axi_ethernet/s_axi_lite_resetn] \
  [get_bd_pins axi_gpio_lcd/s_axi_aresetn] [get_bd_pins axi_ethernet_dma/axi_resetn] [get_bd_pins axi_intc/s_axi_aresetn] \
  [get_bd_pins axi_timer/s_axi_aresetn] [get_bd_pins axi_uart/s_axi_aresetn] [get_bd_pins axi_iic_main/s_axi_aresetn] \
  [get_bd_pins axi_gpio/s_axi_aresetn] [get_bd_pins axi_spi/s_axi_aresetn] [get_bd_pins axi_spdif_tx_core/s_axis_aresetn] \
  [get_bd_pins axi_hdmi_clkgen/s_axi_aresetn] [get_bd_pins axi_hdmi_core/s_axi_aresetn] [get_bd_pins axi_hdmi_dma/axi_resetn] \
  [get_bd_pins axi_spdif_tx_core/s_axi_aresetn] [get_bd_pins axi_spdif_tx_dma/axi_resetn] \
  [get_bd_pins sys_mb1_axi_intc/s_axi_aresetn] [get_bd_pins mailbox_0/S0_AXI_ARESETN] [get_bd_pins mailbox_0/S1_AXI_ARESETN] \
  [get_bd_pins axi_timer_mb1_0/s_axi_aresetn] [get_bd_pins mutex_0/S0_AXI_ARESETN] [get_bd_pins mutex_0/S1_AXI_ARESETN] \
  [get_bd_pins axi_mb0_interconnect/ARESETN] [get_bd_pins axi_mb0_interconnect/S00_ARESETN] \
  [get_bd_pins axi_mb0_interconnect/M00_ARESETN] [get_bd_pins axi_mb0_interconnect/M01_ARESETN] \
  [get_bd_pins axi_mb0_interconnect/M02_ARESETN] [get_bd_pins axi_mb0_interconnect/M03_ARESETN] \
  [get_bd_pins axi_mb0_interconnect/M04_ARESETN] [get_bd_pins axi_mb0_interconnect/M05_ARESETN] \
  [get_bd_pins axi_mb0_interconnect/M06_ARESETN] [get_bd_pins axi_mb0_interconnect/M07_ARESETN] \
  [get_bd_pins axi_mb0_interconnect/M08_ARESETN] [get_bd_pins axi_mb0_interconnect/M09_ARESETN] \
  [get_bd_pins axi_mem_interconnect/ARESETN] [get_bd_pins axi_mem_interconnect/M00_ARESETN] \
  [get_bd_pins axi_mem_interconnect/S00_ARESETN] [get_bd_pins axi_mem_interconnect/S01_ARESETN] \
  [get_bd_pins axi_mem_interconnect/S02_ARESETN] [get_bd_pins axi_mem_interconnect/S03_ARESETN] \
  [get_bd_pins axi_mem_interconnect/S04_ARESETN] [get_bd_pins axi_mb0_interconnect/M10_ARESETN] \
  [get_bd_pins axi_mb0_interconnect/M11_ARESETN] [get_bd_pins axi_mb0_interconnect/M12_ARESETN] \
  [get_bd_pins axi_mb0_interconnect/M13_ARESETN] [get_bd_pins axi_mem_interconnect/S05_ARESETN] \
  [get_bd_pins axi_mem_interconnect/S06_ARESETN] [get_bd_pins axi_mem_interconnect/S07_ARESETN] \
  [get_bd_pins sys_mb1_interconnect/S00_ARESETN] [get_bd_pins sys_mb1_interconnect/M00_ARESETN] \
  [get_bd_pins axi_mem_interconnect/S08_ARESETN] [get_bd_pins axi_mem_interconnect/S09_ARESETN] \
  [get_bd_pins sys_mb1_interconnect/M01_ARESETN] [get_bd_pins sys_mb1_interconnect/M03_ARESETN] \
  [get_bd_pins sys_mb1_interconnect/M02_ARESETN] [get_bd_pins axi_mb0_interconnect/M14_ARESETN] \
  [get_bd_pins sys_mb1_interconnect/M04_ARESETN] [get_bd_pins sys_mb1_interconnect/M05_ARESETN]
# net sys_cpu_reset has one end: sys_rstgen/peripheral_reset
connect_bd_net [get_bd_pins axi_timer/interrupt] [get_bd_pins sys_concat_intc/In0]
connect_bd_net [get_bd_pins axi_ethernet/interrupt] [get_bd_pins sys_concat_intc/In1]
connect_bd_net [get_bd_pins axi_ethernet_dma/mm2s_introut] [get_bd_pins sys_concat_intc/In2]
connect_bd_net [get_bd_pins axi_ethernet_dma/s2mm_introut] [get_bd_pins sys_concat_intc/In3]
connect_bd_net [get_bd_pins axi_uart/interrupt] [get_bd_pins sys_concat_intc/In4]
connect_bd_net [get_bd_pins axi_gpio_lcd/ip2intc_irpt] [get_bd_pins sys_concat_intc/In5]
connect_bd_net -net mb_intr_06_1 [get_bd_ports mb_intr_06] [get_bd_pins sys_concat_intc/In6]
connect_bd_net [get_bd_pins axi_iic_main/iic2intc_irpt] [get_bd_pins sys_concat_intc/In9]
connect_bd_net [get_bd_pins axi_spi/ip2intc_irpt] [get_bd_pins sys_concat_intc/In10]
connect_bd_net -net mb_intr_12_1 [get_bd_ports mb_intr_12] [get_bd_pins sys_concat_intc/In12]
connect_bd_net -net mb_intr_13_1 [get_bd_ports mb_intr_13] [get_bd_pins sys_concat_intc/In13]
connect_bd_net -net mb_intr_14_1 [get_bd_ports mb_intr_14] [get_bd_pins sys_concat_intc/In14]
connect_bd_net [get_bd_ports sys_rst] [get_bd_pins sys_rstgen/ext_reset_in] [get_bd_pins axi_ddr_cntrl/sys_rst]
connect_bd_net [get_bd_ports sys_clk_p] [get_bd_pins axi_ddr_cntrl/sys_clk_p]
connect_bd_net [get_bd_ports sys_clk_n] [get_bd_pins axi_ddr_cntrl/sys_clk_n]
connect_bd_net [get_bd_ports uart_sin] [get_bd_pins axi_uart/rx]
connect_bd_net [get_bd_pins axi_uart/tx] [get_bd_ports uart_sout]
connect_bd_net [get_bd_ports spi_csn_i] [get_bd_pins axi_spi/ss_i]
connect_bd_net [get_bd_pins axi_spi/ss_o] [get_bd_ports spi_csn_o]
connect_bd_net [get_bd_ports spi_clk_i] [get_bd_pins axi_spi/sck_i]
connect_bd_net [get_bd_pins axi_spi/sck_o] [get_bd_ports spi_clk_o]
connect_bd_net [get_bd_ports spi_sdo_i] [get_bd_pins axi_spi/io0_i]
connect_bd_net [get_bd_pins axi_spi/io0_o] [get_bd_ports spi_sdo_o]
connect_bd_net [get_bd_ports spi_sdi_i] [get_bd_pins axi_spi/io1_i]
connect_bd_net [get_bd_ports gpio0_i] [get_bd_pins axi_gpio/gpio_io_i]
connect_bd_net [get_bd_pins axi_gpio/gpio_io_o] [get_bd_ports gpio0_o]
connect_bd_net [get_bd_pins axi_gpio/gpio_io_t] [get_bd_ports gpio0_t]
connect_bd_net [get_bd_ports gpio1_i] [get_bd_pins axi_gpio/gpio2_io_i]
connect_bd_net [get_bd_pins axi_gpio/gpio2_io_o] [get_bd_ports gpio1_o]
connect_bd_net [get_bd_pins axi_gpio/gpio2_io_t] [get_bd_ports gpio1_t]
connect_bd_net [get_bd_pins sys_ethernet_clkgen/clk_out1] [get_bd_pins axi_ethernet/gtx_clk]
connect_bd_net [get_bd_pins axi_ethernet/phy_rst_n] [get_bd_ports phy_rst_n]
connect_bd_net [get_bd_pins axi_ethernet_dma/mm2s_prmry_reset_out_n] [get_bd_pins axi_ethernet/axi_txd_arstn]
connect_bd_net [get_bd_pins axi_ethernet_dma/mm2s_cntrl_reset_out_n] [get_bd_pins axi_ethernet/axi_txc_arstn]
connect_bd_net [get_bd_pins axi_ethernet_dma/s2mm_prmry_reset_out_n] [get_bd_pins axi_ethernet/axi_rxd_arstn]
connect_bd_net [get_bd_pins axi_ethernet_dma/s2mm_sts_reset_out_n] [get_bd_pins axi_ethernet/axi_rxs_arstn]
connect_bd_net [get_bd_pins axi_hdmi_clkgen/clk_0] [get_bd_pins axi_hdmi_core/hdmi_clk]
connect_bd_net [get_bd_pins axi_hdmi_core/hdmi_out_clk] [get_bd_ports hdmi_out_clk]
connect_bd_net [get_bd_pins axi_hdmi_core/hdmi_16_hsync] [get_bd_ports hdmi_16_hsync]
connect_bd_net [get_bd_pins axi_hdmi_core/hdmi_16_vsync] [get_bd_ports hdmi_16_vsync]
connect_bd_net [get_bd_pins axi_hdmi_core/hdmi_16_data_e] [get_bd_ports hdmi_16_data_e]
connect_bd_net [get_bd_pins axi_hdmi_core/hdmi_16_data] [get_bd_ports hdmi_16_data]
connect_bd_net [get_bd_pins axi_hdmi_core/hdmi_24_hsync] [get_bd_ports hdmi_24_hsync]
connect_bd_net [get_bd_pins axi_hdmi_core/hdmi_24_vsync] [get_bd_ports hdmi_24_vsync]
connect_bd_net [get_bd_pins axi_hdmi_core/hdmi_24_data_e] [get_bd_ports hdmi_24_data_e]
connect_bd_net [get_bd_pins axi_hdmi_core/hdmi_24_data] [get_bd_ports hdmi_24_data]
connect_bd_net [get_bd_pins axi_hdmi_core/hdmi_36_hsync] [get_bd_ports hdmi_36_hsync]
connect_bd_net [get_bd_pins axi_hdmi_core/hdmi_36_vsync] [get_bd_ports hdmi_36_vsync]
connect_bd_net [get_bd_pins axi_hdmi_core/hdmi_36_data_e] [get_bd_ports hdmi_36_data_e]
connect_bd_net [get_bd_pins axi_hdmi_core/hdmi_36_data] [get_bd_ports hdmi_36_data]
connect_bd_net [get_bd_pins axi_hdmi_dma/m_axis_mm2s_tvalid] [get_bd_pins axi_hdmi_core/vdma_valid]
connect_bd_net [get_bd_pins axi_hdmi_dma/m_axis_mm2s_tdata] [get_bd_pins axi_hdmi_core/vdma_data]
connect_bd_net [get_bd_pins axi_hdmi_core/vdma_ready] [get_bd_pins axi_hdmi_dma/m_axis_mm2s_tready]
connect_bd_net [get_bd_pins axi_hdmi_core/vdma_fs] [get_bd_pins axi_hdmi_dma/mm2s_fsync] [get_bd_pins axi_hdmi_core/vdma_fs_ret]
connect_bd_net [get_bd_pins axi_spdif_tx_dma/m_axis_mm2s_tvalid] [get_bd_pins axi_spdif_tx_core/s_axis_tvalid]
connect_bd_net [get_bd_pins axi_spdif_tx_dma/m_axis_mm2s_tdata] [get_bd_pins axi_spdif_tx_core/s_axis_tdata]
connect_bd_net [get_bd_pins axi_spdif_tx_dma/m_axis_mm2s_tlast] [get_bd_pins axi_spdif_tx_core/s_axis_tlast]
connect_bd_net [get_bd_pins axi_spdif_tx_core/s_axis_tready] [get_bd_pins axi_spdif_tx_dma/m_axis_mm2s_tready]
connect_bd_net [get_bd_pins sys_audio_clkgen/clk_out1] [get_bd_pins axi_spdif_tx_core/spdif_data_clk]
connect_bd_net [get_bd_pins axi_spdif_tx_core/spdif_tx_o] [get_bd_ports spdif]
connect_bd_net [get_bd_pins axi_hdmi_dma/mm2s_introut] [get_bd_pins sys_concat_intc/In8]
connect_bd_net [get_bd_pins axi_spdif_tx_dma/mm2s_introut] [get_bd_pins sys_concat_intc/In7]
connect_bd_net [get_bd_pins sys_rstgen/interconnect_aresetn] [get_bd_pins sys_mb1_interconnect/ARESETN]
connect_bd_net -net mb_intr_15_1 [get_bd_ports mb_intr_15] [get_bd_pins sys_concat_intc/In11]
connect_bd_net -net xlconcat_0_dout [get_bd_pins xlconcat_mb1_intr/dout] [get_bd_pins sys_mb1_axi_intc/intr]
connect_bd_net [get_bd_pins axi_timer_mb1_0/interrupt] [get_bd_pins xlconcat_mb1_intr/In0]
connect_bd_net [get_bd_pins axi_gpio/ip2intc_irpt] [get_bd_pins xlconcat_mb1_intr/In1]
connect_bd_net [get_bd_pins mailbox_0/Interrupt_0] [get_bd_pins sys_concat_intc/In15]
connect_bd_net [get_bd_pins mailbox_0/Interrupt_1] [get_bd_pins xlconcat_mb1_intr/In2]
connect_bd_net [get_bd_pins sys_debug/Interrupt] [get_bd_pins xlconcat_mb1_intr/In3]

# ---- address map ----
assign_bd_address -offset 0x80000000 -range 1G -target_address_space [get_bd_addr_spaces axi_ethernet_dma/Data_MM2S] [get_bd_addr_segs axi_ddr_cntrl/memmap/memaddr]
assign_bd_address -offset 0x80000000 -range 1G -target_address_space [get_bd_addr_spaces axi_ethernet_dma/Data_S2MM] [get_bd_addr_segs axi_ddr_cntrl/memmap/memaddr]
assign_bd_address -offset 0x80000000 -range 1G -target_address_space [get_bd_addr_spaces axi_ethernet_dma/Data_SG] [get_bd_addr_segs axi_ddr_cntrl/memmap/memaddr]
assign_bd_address -offset 0x80000000 -range 1G -target_address_space [get_bd_addr_spaces axi_hdmi_dma/Data_MM2S] [get_bd_addr_segs axi_ddr_cntrl/memmap/memaddr]
assign_bd_address -offset 0x80000000 -range 1G -target_address_space [get_bd_addr_spaces axi_spdif_tx_dma/Data_MM2S] [get_bd_addr_segs axi_ddr_cntrl/memmap/memaddr]
assign_bd_address -offset 0x80000000 -range 1G -target_address_space [get_bd_addr_spaces axi_spdif_tx_dma/Data_SG] [get_bd_addr_segs axi_ddr_cntrl/memmap/memaddr]
assign_bd_address -offset 0x00000000 -range 8K -target_address_space [get_bd_addr_spaces mb0/Data] [get_bd_addr_segs sys_dlmb_cntlr/SLMB/Mem]
assign_bd_address -offset 0x40010000 -range 4K -target_address_space [get_bd_addr_spaces mb0/Data] [get_bd_addr_segs axi_gpio_lcd/S_AXI/Reg]
assign_bd_address -offset 0x40600000 -range 64K -target_address_space [get_bd_addr_spaces mb0/Data] [get_bd_addr_segs axi_uart/S_AXI/Reg]
assign_bd_address -offset 0x40E00000 -range 256K -target_address_space [get_bd_addr_spaces mb0/Data] [get_bd_addr_segs axi_ethernet/s_axi/Reg0]
assign_bd_address -offset 0x41200000 -range 4K -target_address_space [get_bd_addr_spaces mb0/Data] [get_bd_addr_segs axi_intc/S_AXI/Reg]
assign_bd_address -offset 0x41600000 -range 4K -target_address_space [get_bd_addr_spaces mb0/Data] [get_bd_addr_segs axi_iic_main/S_AXI/Reg]
assign_bd_address -offset 0x41C00000 -range 4K -target_address_space [get_bd_addr_spaces mb0/Data] [get_bd_addr_segs axi_timer/S_AXI/Reg]
assign_bd_address -offset 0x41E00000 -range 64K -target_address_space [get_bd_addr_spaces mb0/Data] [get_bd_addr_segs axi_spdif_tx_dma/S_AXI_LITE/Reg]
assign_bd_address -offset 0x41E10000 -range 4K -target_address_space [get_bd_addr_spaces mb0/Data] [get_bd_addr_segs axi_ethernet_dma/S_AXI_LITE/Reg]
assign_bd_address -offset 0x43000000 -range 4K -target_address_space [get_bd_addr_spaces mb0/Data] [get_bd_addr_segs axi_hdmi_dma/S_AXI_LITE/Reg]
assign_bd_address -offset 0x43400000 -range 64K -target_address_space [get_bd_addr_spaces mb0/Data] [get_bd_addr_segs mutex_0/S0_AXI/Reg]
assign_bd_address -offset 0x43600000 -range 64K -target_address_space [get_bd_addr_spaces mb0/Data] [get_bd_addr_segs mailbox_0/S0_AXI/Reg]
assign_bd_address -offset 0x44A70000 -range 64K -target_address_space [get_bd_addr_spaces mb0/Data] [get_bd_addr_segs axi_spi/AXI_LITE/Reg]
assign_bd_address -offset 0x70E00000 -range 64K -target_address_space [get_bd_addr_spaces mb0/Data] [get_bd_addr_segs axi_hdmi_core/s_axi/axi_lite]
assign_bd_address -offset 0x75C00000 -range 64K -target_address_space [get_bd_addr_spaces mb0/Data] [get_bd_addr_segs axi_spdif_tx_core/s_axi/axi_lite]
assign_bd_address -offset 0x79000000 -range 64K -target_address_space [get_bd_addr_spaces mb0/Data] [get_bd_addr_segs axi_hdmi_clkgen/s_axi/axi_lite]
assign_bd_address -offset 0x80000000 -range 1G -target_address_space [get_bd_addr_spaces mb0/Data] [get_bd_addr_segs axi_ddr_cntrl/memmap/memaddr]
assign_bd_address -offset 0x00000000 -range 8K -target_address_space [get_bd_addr_spaces mb0/Instruction] [get_bd_addr_segs sys_ilmb_cntlr/SLMB/Mem]
assign_bd_address -offset 0x80000000 -range 1G -target_address_space [get_bd_addr_spaces mb0/Instruction] [get_bd_addr_segs axi_ddr_cntrl/memmap/memaddr]
assign_bd_address -offset 0x00000000 -range 8K -target_address_space [get_bd_addr_spaces mb1/Data] [get_bd_addr_segs sys_mb1_local_memory/dlmb_bram_if_cntlr/SLMB/Mem]
assign_bd_address -offset 0x40000000 -range 64K -target_address_space [get_bd_addr_spaces mb1/Data] [get_bd_addr_segs axi_gpio/S_AXI/Reg]
assign_bd_address -offset 0x41200000 -range 64K -target_address_space [get_bd_addr_spaces mb1/Data] [get_bd_addr_segs sys_mb1_axi_intc/S_AXI/Reg]
assign_bd_address -offset 0x41400000 -range 4K -target_address_space [get_bd_addr_spaces mb1/Data] [get_bd_addr_segs sys_debug/S_AXI/Reg]
assign_bd_address -offset 0x41C00000 -range 64K -target_address_space [get_bd_addr_spaces mb1/Data] [get_bd_addr_segs axi_timer_mb1_0/S_AXI/Reg]
assign_bd_address -offset 0x43410000 -range 64K -target_address_space [get_bd_addr_spaces mb1/Data] [get_bd_addr_segs mutex_0/S1_AXI/S1_AXI_Reg]
assign_bd_address -offset 0x43610000 -range 64K -target_address_space [get_bd_addr_spaces mb1/Data] [get_bd_addr_segs mailbox_0/S1_AXI/Reg]
assign_bd_address -offset 0x80000000 -range 1G -target_address_space [get_bd_addr_spaces mb1/Data] [get_bd_addr_segs axi_ddr_cntrl/memmap/memaddr]
assign_bd_address -offset 0x00000000 -range 8K -target_address_space [get_bd_addr_spaces mb1/Instruction] [get_bd_addr_segs sys_mb1_local_memory/ilmb_bram_if_cntlr/SLMB/Mem]
assign_bd_address -offset 0x80000000 -range 1G -target_address_space [get_bd_addr_spaces mb1/Instruction] [get_bd_addr_segs axi_ddr_cntrl/memmap/memaddr]

validate_bd_design
save_bd_design
